# Altium schematic sheet 示波器原理图4.SchDoc
size A4
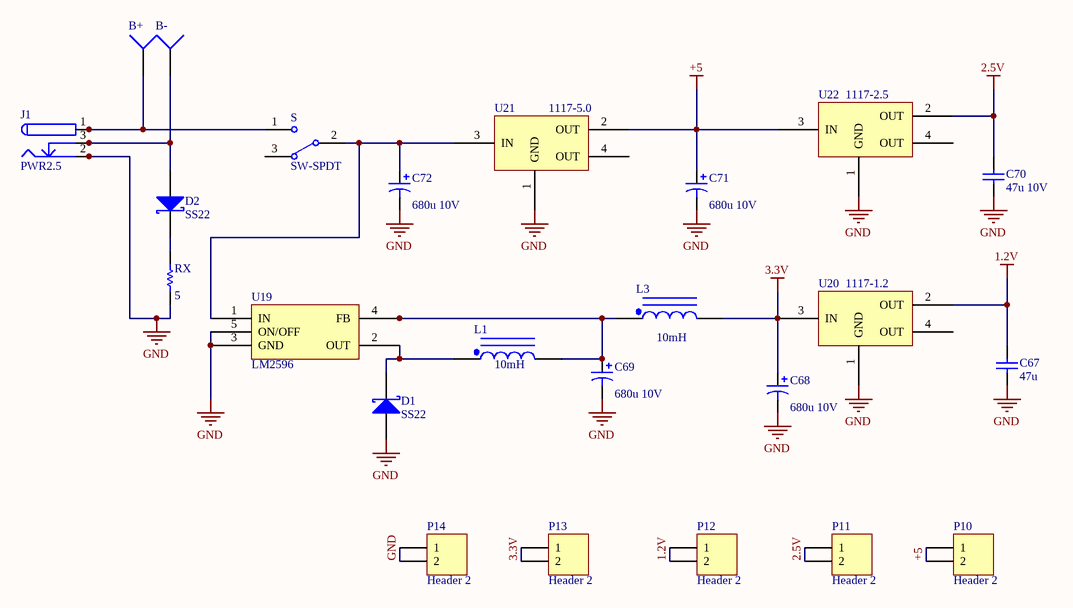
[diagram p0: 示波器原理图4.SchDoc]

## Parts
B+  (no value)  [PIN1]
B-  (no value)  [PIN1]
C67  value 47u  [VP32-3.2]
C68  value 680u 10V  [C0805]
C69  value 680u 10V  [C0805]
C70  value 47u 10V  [VP32-3.2]
C71  value 680u 10V  [C0805]
C72  value 680u 10V  [C0805]
D1  SS22  [SMB]
D2  SS22  [SMB]
J1  PWR2.5  [KLD-0202]
L1  value 10mH  [DIODE_SMC]
L3  value 10mH  [DIODE_SMC]
P10  Header 2  [HDR1X2]
P11  Header 2  [HDR1X2]
P12  Header 2  [HDR1X2]
P13  Header 2  [HDR1X2]
P14  Header 2  [HDR1X2]
RX  value 5  [AXIAL-0.3]
S  SW-SPDT  [TL36WW15050]
U19  LM2596
U20  1117-1.2  [Model Name]
U21  1117-5.0  [PCBComponent_1]
U22  1117-2.5  [PCBComponent_1]

## Nets
1.2V: C67.1 P12.1 P12.2 U20.2(OUT)
2.5V: C70.1 P11.1 P11.2 U22.2(OUT)
3.3V: C68.1 L3.2 P13.1 P13.2 U20.3(IN)
+5: C71.1 P10.1 P10.2 U21.2(OUT) U22.3(IN)
GND: C67.2 C68.2 C69.2 C70.2 C71.2 C72.2 D1.1(A) J1.2 J1.2A J1.2B P14.1 P14.2 RX.1 U19.3(GND) U19.5(ON/OFF) U20.1(GND) U21.1(GND) U22.1(GND)
NetB+_1: B+.1 J1.1 J1.1A J1.1B S.1
NetB-_1: B-.1 D2.1(A) J1.3 J1.3A J1.3B
NetC69_1: C69.1 L1.2 L3.1 U19.4(FB)
NetC72_1: C72.1 S.2 U19.1(IN) U21.3(IN)
NetD1_2: D1.2(K) L1.1 U19.2(OUT)
NetD2_2: D2.2(K) RX.2

Not connected (* = marked no-connect by the designer): S 3; U20 4(OUT); U21 4(OUT); U22 4(OUT)

## Library data of the parts
B+ B- = Socket: LatestRevisionDate: 17-Jul-2002; LatestRevisionNote: Re-released for DXP Platform.; Publisher: Altium Limited
C67 C70 = Cap: Capacitor; Published: 8-Jun-2000; LatestRevisionDate: 17-Jul-2002; LatestRevisionNote: Re-released for DXP Platform.; PackageReference: RAD-0.3; Publisher: Altium Limited
C68 C69 C71 C72 = Cap Pol3: Polarized Capacitor (Surface Mount); Published: 8-Jun-2000; LatestRevisionDate: 17-Jul-2002; LatestRevisionNote: Re-released for DXP Platform.; PackageReference: C0805; Publisher: Altium Limited
D1 D2 = D Schottky: Schottky Diode; Published: 8-Jun-2000; LatestRevisionDate: 17-Jul-2002; LatestRevisionNote: Re-released for DXP Platform.; PackageReference: SMB; Publisher: Altium Limited; Code_JEDEC: DO-214-AA
J1 = PWR2.5: Low Voltage Power Supply Connector; Published: 17-Dec-2003; DatasheetDocument: 09-May-2002; Publisher: Altium Limited; ComponentLink1Description: Manufacturer Link; ComponentLink1URL: http://domino.kycon.com/internet/Products.html
L1 L3 = Inductor Iron Dot: Magnetic-Core Inductor with Winding Polarity Marking; Published: 24-Mar-1999; LatestRevisionDate: 17-Jul-2002; LatestRevisionNote: Re-released for DXP Platform.; PackageReference: DIODE_SMC; Publisher: Altium Limited
P10-P14 = Header 2: Header, 2-Pin; LatestRevisionDate: 17-Jul-2002; LatestRevisionNote: Re-released for DXP Platform.; Publisher: Altium Limited
RX = Res1: Resistor; Published: 8-Jun-2000; LatestRevisionDate: 17-Jul-2002; LatestRevisionNote: Re-released for DXP Platform.; PackageReference: AXIAL-0.3; Publisher: Altium Limited
S = SW-SPDT: SPDT Subminiature Toggle Switch, Right Angle Mounting, Vertical Actuation; Published: 24-Mar-1999; LatestRevisionDate: 17-Dec-2003; LatestRevisionNote: Schematic revised, PCB Footprint replaced.; DatasheetDocument: 05-Dec-2000; PackageReference: TL36WW15050; Publisher: Altium Limited; ComponentLink1Description: Manufacturer Link; ComponentLink1URL: http://www.apem.com
U19-U22 = Component_1